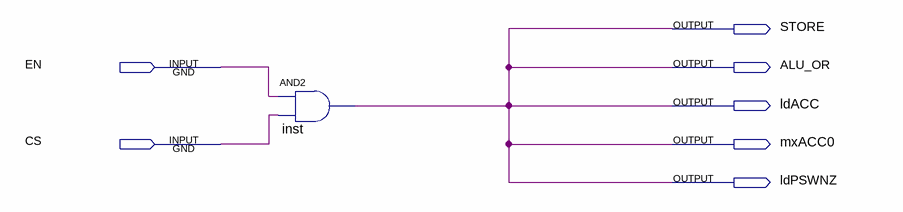
[diagram p0: schematic sheet]
// Quartus schematic OR_.bdf as structural Verilog: 1 symbols, 7 pins
module OR_ (
  input  EN,
  input  CS,
  output STORE,
  output ALU_OR,
  output ldACC,
  output mxACC0,
  output ldPSWNZ
);

  and inst (ALU_OR, EN, CS);

  assign ldACC = ALU_OR;
  assign ldPSWNZ = ALU_OR;
  assign mxACC0 = ALU_OR;
  assign STORE = ALU_OR;
endmodule
